# Altium schematic sheet usb.schdoc
size 297 x 209 mm; Symbol: Drawing-Symbol_A4; @Project Name: Odin; @Page Count: 8; @Update Date: 2025-12-15; @Create Date: 2025-12-15; @Schematic Name: Odin; @Page No: 8; @Page Name: usb; Company: EasyEDA.com; Version: V1.0; Page Size: A4; @Create Time: 16:42:55; @Update Time: 11:47:04; Border: 1; Width: 1170; Height: 825; Region Start: 1; X Region Count: 6; Y Region Count: 4; Blade Width: 10; Title Block Position: 3; @Board Name: Odin_V1.0.0; Device: Drawing-Symbol_A4
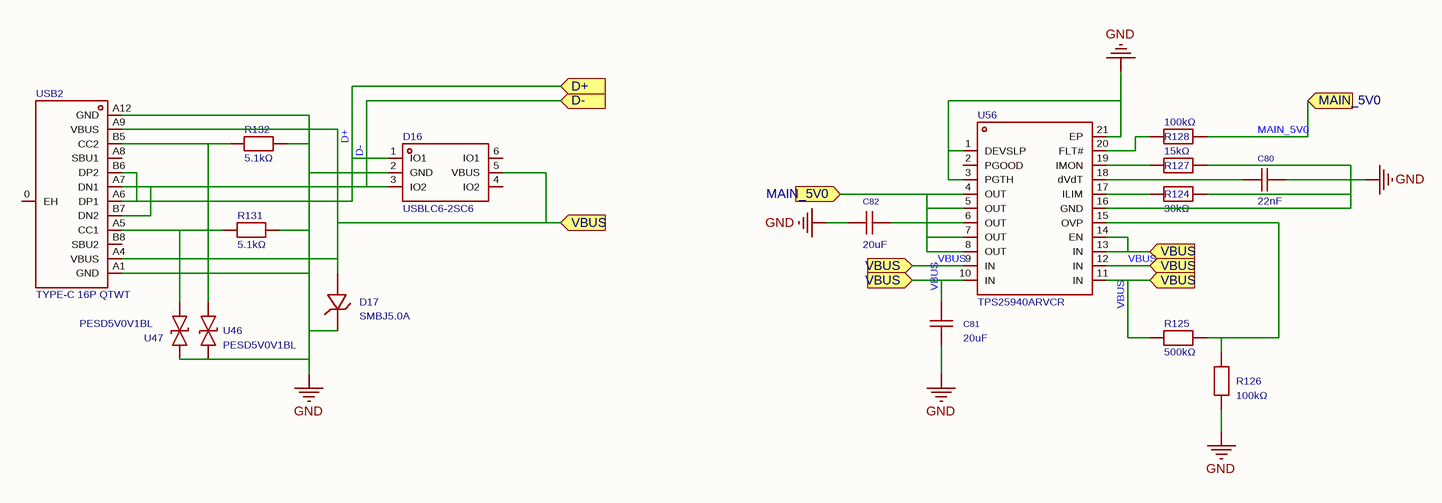
[diagram p0: usb.schdoc]

## Parts
C80  22nF  [C0603]
C81  20uF  [C0603]
C82  20uF  [C0603]
D16  USBLC6-2SC6  [SOT-23-6_L2.9-W1.6-P0.95-LS2.8-BL]
D17  SMBJ5.0A  [SMB_L4.6-W3.6-LS5.3-RD]
R124  30kΩ  [R0402]
R125  500kΩ  [R0402]
R126  100kΩ  [R0402]
R127  15kΩ  [R0402]
R128  100kΩ  [R0402]
R131  5.1kΩ  [R0402]
R132  5.1kΩ  [R0402]
U46  PESD5V0V1BL  [DFN1006-2L-BI]
U47  PESD5V0V1BL  [DFN1006-2L-BI]
U56  TPS25940ARVCR  [WQFN-20_L4.0-W3.0-P0.50-BL-EP]
USB2  TYPE-C 16P QTWT  [USB-TYPE-C-SMD_TYPE-C-16P-QTWT]

## Ports
D+ (in), D- (in), MAIN_5V0 (in), VBUS (in)

## Nets
GND: C80.2 C81.1 C82.2 D16.2(GND) D17.1 R124.2 R126.2 R127.2 R131.1 R132.1 U46.2 U47.2 U56.1(DEVSLP) U56.3(PGTH) U56.16(GND) U56.21(EP) USB2.A1(GND) USB2.A12(GND)
D+: D16.1(IO1) USB2.A6(DP1) USB2.B6(DP2) ; port D+
D-: D16.3(IO2) USB2.A7(DN1) USB2.B7(DN2) ; port D-
MAIN_5V0: C82.1 R128.2 U56.4(OUT) U56.5(OUT) U56.6(OUT) U56.7(OUT) U56.8(OUT) ; port MAIN_5V0
VBUS: C81.2 D16.5(VBUS) D17.2 R125.1 U56.9(IN) U56.10(IN) U56.11(IN) U56.12(IN) U56.13(IN) U56.14(EN) USB2.A4(VBUS) USB2.A9(VBUS) ; port VBUS
NetC80_1: C80.1 U56.18(dVdT)
NetR124_1: R124.1 U56.17(ILIM)
NetR125_2: R125.2 R126.1 U56.15(OVP)
NetR127_1: R127.1 U56.19(IMON)
NetR128_1: R128.1 U56.20(FLT#)
NetR131_2: R131.2 U47.1 USB2.A5(CC1)
NetR132_2: R132.2 U46.1 USB2.B5(CC2)

Not connected (* = marked no-connect by the designer): D16 4(IO2) 6(IO1); U56 2(PGOOD); USB2 0(EH) A8(SBU1) B8(SBU2)

## Notes on the sheet
- Create at
- 2025-12-15
- Schematic
- Board
- Odin
- Odin_V1.0.0
- Update at
- Page
- usb
- Drawn
- Reviewed
- Version
- V1.0
- Size
- A4
- Page  8  Total  8
- EasyEDA.com

## Library data of the parts
C80-C82 = CL10B223KB8NNNC: Capacitance:22nF Tolerance:±10% Tolerance:±10% Voltage Rating:50V Temperature Coefficient:X7R; Manufacturer: SAMSUNG(三星); AddInBom: yes; ModelId: 624118aa3cc7497086c383c2d72e0852; ModelName: C0603_L1.6-W0.8-H0.8; ModelTransform: 62.992,31.496,0,0,0,0,0,0,0; Tolerance: ±10%; Voltage Rating: 50V; Temperature Coefficient: X7R; Symbol: CL10B223KB8NNNC; Device: CL10B223KB8NNNC; Supplier: LCSC; Manufacturer Part: CL10B223KB8NNNC; JLCPCB Part Class: Basic Part; LCSC Part Name: 22nF ±10% 50V; Supplier Footprint: 0603; Datasheet: https://item.szlcsc.com/datasheet/CL10B223KB8NNNC/21834.html; ConvertToPcb: yes; FootprintName: C0603
  C80: Value: 22nF; Supplier Part: C21122
  C81 C82: Value: 20uF
D16 = USBLC6-2SC6_C2827654: Polarity:Unidirectional Reverse Stand-Off Voltage (Vrwm):5V Clamping Voltage:12V Peak Pulse Current (Ipp):6A Peak Pulse Power Dissipation (Ppp):150W Voltage - Breakdown:6V Reverse Leakage Current (Ir):80nA Number of Channels:2 Operating Temperature:-55℃~+; Manufacturer: TECH PUBLIC(台舟); AddInBom: yes; ModelId: 1370be37a17e44418ae52e2b4cc1f5e5; ModelName: SOT-23-6_L2.9-W1.6-H1.5-LS2.8-P0.95; ModelTransform: 110.236,113.364,0,90,0,0,0.0005,0.0005,0; Reverse Stand-Off Voltage (Vrwm): 5V; Clamping Voltage: 12V; Peak Pulse Current (Ipp): 6A; Peak Pulse Power Dissipation (Ppp): 150W; Voltage - Breakdown: 6V; Reverse Leakage Current (Ir): 80nA; Number of Channels: 2; level of protection: IEC 61000-4-2；IEC 61000-4-4；IEC 61000-4-5; Type: ESD; Junction Capacitance: 0.35pF; Symbol: USBLC6-2SC6_C2827654; Device: USBLC6-2SC6_C2827654; LCSC Part Name: ESD，可防30kV静电; SupplierPart: C2827654; ManufacturerPart: USBLC6-2SC6; Supplier Footprint: SOT-23-6; JLCPCB Part Class: Extended Part; Datasheet: https://item.szlcsc.com/datasheet/USBLC6-2SC6/2973336.html; Supplier: LCSC; ConvertToPcb: yes; FootprintName: SOT-23-6_L2.9-W1.6-P0.95-LS2.8-BL; Polarity: Unidirectional; Operating Temperature: -55℃~+125℃
D17 = SMBJ5.0A_C83333: Polarity:Unidirectional Reverse Stand-Off Voltage (Vrwm):5V Clamping Voltage:9.2V Peak Pulse Current (Ipp):65.3A Peak Pulse Power Dissipation (Ppp):600W Voltage - Breakdown:6.4V Reverse Leakage Current (Ir):65.3uA Operating Temperature:-65℃~+150℃ Operatin; Manufacturer: Littelfuse(美国力特); AddInBom: yes; ModelId: 892cc756ed79448ab4afad0e5bfcdfa6; ModelTransform: 212.598,141.732,0,0,0,0,0,0,0; Reverse Stand-Off Voltage (Vrwm): 5V; Clamping Voltage: 9.2V; Peak Pulse Current (Ipp): 65.3A; Peak Pulse Power Dissipation (Ppp): 600W; Voltage - Breakdown: 6.4V; Reverse Leakage Current (Ir): 65.3uA; level of protection: IEC 61000-4-4；IEC 61000-4-2; Type: TVS; Symbol: SMBJ5.0A_C83333; Device: SMBJ5.0A_C83333; LCSC Part Name: 单向TVS 5V截止 峰值浪涌电流：65.3A; SupplierPart: C83333; ManufacturerPart: SMBJ5.0A; Supplier Footprint: DO-214AA; JLCPCB Part Class: Extended Part; Datasheet: https://item.szlcsc.com/datasheet/SMBJ5.0A/84497.html; Supplier: LCSC; ConvertToPcb: yes; FootprintName: SMB_L4.6-W3.6-LS5.3-RD; ModelName: SMB_L4.6-W3.6-LS5.3-RD; Polarity: Unidirectional; Operating Temperature: -65℃~+150℃
R124-R128 R131 R132 = FRC0402F3002TS: Type:Thick Film Resistor Resistance:30kΩ Tolerance:±1% Tolerance:±1% Power(Watts):62.5mW Voltage-Supply(Max):50V Temperature Coefficient:±100ppm/℃ Temperature Coefficient:±100ppm/℃ Operating Temperature:-55℃~+155℃ Operating Temperature:-55℃~+155℃; Manufacturer: FOJAN(富捷); AddInBom: yes; ModelId: efdecb7dae4442949d28eecaf748420f; ModelName: R0402_L1.0-W0.5-H0.4; ModelTransform: 39.37,19.685,0,0,0,0,0,0,0; Tolerance: ±1%; Power(Watts): 62.5mW; Voltage-Supply(Max): 50V; Symbol: FRC0402F3002TS; Device: FRC0402F3002TS; LCSC Part Name: 30kΩ ±1% 62.5mW 厚膜电阻; ManufacturerPart: FRC0402F3002TS; Supplier Footprint: 0402; JLCPCB Part Class: Extended Part; Supplier: LCSC; ConvertToPcb: yes; FootprintName: R0402; Type: Thick Film Resistor; Temperature Coefficient: ±100ppm/℃; Operating Temperature: -55℃~+155℃
  R124: SupplierPart: C2909347; Value: 30kΩ
  R125: Value: 500kΩ
  R126 R128: Value: 100kΩ
  R127: Value: 15kΩ
  R131 R132: Value: 5.1kΩ
U46 U47 = PESD5V0V1BL: Reverse Stand-Off Voltage (Vrwm):5V Clamping Voltage:11V Voltage - Breakdown:8.4V Reverse Leakage Current (Ir):80nA level of protection:IEC 61000-4-5；IEC 61000-4-2 Type:ESD Junction Capacitance:12pF; Manufacturer: TECH PUBLIC(台舟); Symbol: PESD5V0V1BL_C2827735; AddInBom: yes; ModelId: bd25370e05ab4a62b9ffc7ec72ba1585; ModelTransform: 40.1574,24.4094,0,0,0,0,0,0,0; Reverse Stand-Off Voltage (Vrwm): 5V; Clamping Voltage: 11V; Voltage - Breakdown: 8.4V; Reverse Leakage Current (Ir): 80nA; Junction Capacitance: 12pF; Device: PESD5V0V1BL; LCSC Part Name: PESD5V0V1BL; SupplierPart: C2827735; ManufacturerPart: PESD5V0V1BL; Supplier Footprint: DFN1006-2; JLCPCB Part Class: Extended Part; Datasheet: https://item.szlcsc.com/datasheet/PESD5V0V1BL/2973417.html; Supplier: LCSC; ConvertToPcb: yes; FootprintName: DFN1006-2L-BI; ModelName: DFN1006-2L-BI; level of protection: IEC 61000-4-5；IEC 61000-4-2; Type: ESD
U56 = TPS25940ARVCR: Maximum Continuous Current:5.2A Voltage - Supply:2.7V~18V Voltage - Supply:2.7V~18V RDS(on):42mΩ Operating Temperature-:-40℃~+125℃ Operating Temperature-:-40℃~+125℃ Features:Over Temperature Protection；Over Voltage Protection；Short-Circuit  Protection(S; Manufacturer: TI(德州仪器); AddInBom: yes; ModelId: c34d53f6ed0544b58ed7f2e43a97796b; ModelName: WQFN-20_L4.0-W3.0-H0.8-P0.50; ModelTransform: 158.267,118.8974,0,0,0,0,-0.005,-0.003,0; Maximum Continuous Current: 5.2A; RDS(on): 42mΩ; Symbol: TPS25940ARVCR; Device: TPS25940ARVCR; LCSC Part Name: 2.7V－18V电子熔丝(eFuse)，具有真正反向阻断和针对固态硬盘(SSD)的DevSleep支持; SupplierPart: C2653873; ManufacturerPart: TPS25940ARVCR; Supplier Footprint: WQFN-20-EP(3x4); JLCPCB Part Class: Extended Part; Datasheet: https://www.ti.com/cn/lit/gpn/tps25940; Supplier: LCSC; ConvertToPcb: yes; FootprintName: WQFN-20_L4.0-W3.0-P0.50-BL-EP; Voltage - Supply: 2.7V~18V; Operating Temperature	-: -40℃~+125℃; Features: Over Temperature Protection；Over Voltage Protection；Short-Circuit  Protection(SCP)；Undervoltage Protection(UVP)；Overcurrent Protection(OCP)
USB2 = TYPE-C 16P QTWT: Connector Type:Type-C Protocol Standard:USB 3.1 Gender:Female Mounting Type:Surface Mount, Right Angle Number of Contacts:16P Number of Ports:1 Current Rating-Power:3A Voltage Rating:5V Connect-Disconnect Life:5,000 Cycles Supplementary Features:- Center; Manufacturer: SHOU HAN(首韩); AddInBom: yes; ModelId: 74dd723c88cc4dffb54eac9ae5e546e7; ModelTransform: 446.456,299.12133,0,0,0,0,-0.002,-49.213,-27.559; Protocol Standard: USB 3.1; Gender: Female; Number of Ports: 1; Current Rating-Power: 3A; Voltage Rating: 5V; Detection color: Black; Symbol: TYPE-C 16P QTWT; Device: TYPE-C 16P QTWT; LCSC Part Name: Type-C 母 卧贴; SupplierPart: C5187472; ManufacturerPart: TYPE-C 16P QTWT; Supplier Footprint: SMD; JLCPCB Part Class: Extended Part; Datasheet: https://item.szlcsc.com/datasheet/TYPE-C%252016P%2520QTWT/5860367.html; Supplier: LCSC; ConvertToPcb: yes; FootprintName: USB-TYPE-C-SMD_TYPE-C-16P-QTWT; ModelName: USB-TYPE-C-SMD_TYPE-C-16P-QTWT; Connector Type: Type-C; Mounting Type: Surface Mount, Right Angle; Number of Contacts: 16P; Connect-Disconnect Life: 5,000 Cycles; Supplementary Features: -; Center Height: -; Length: -; Operating Temperature: -25℃~+85℃